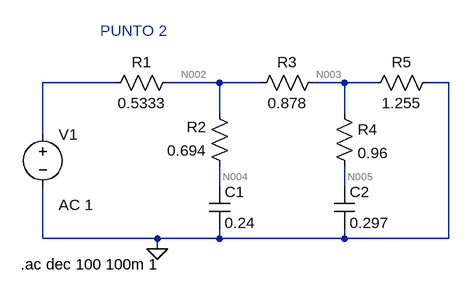
[diagram p0: schematic punto_2.asc]
punto_2.asc, the LTspice schematic file:
Version 4
SHEET 1 1124 680
WIRE 80 -32 -32 -32
WIRE 240 -32 160 -32
WIRE 304 -32 240 -32
WIRE 432 -32 384 -32
WIRE 480 -32 432 -32
WIRE 592 -32 560 -32
WIRE 240 16 240 -32
WIRE 432 16 432 -32
WIRE -32 48 -32 -32
WIRE 240 128 240 96
WIRE 432 128 432 96
WIRE -32 208 -32 128
WIRE 144 208 -32 208
WIRE 240 208 240 192
WIRE 240 208 144 208
WIRE 432 208 432 192
WIRE 432 208 240 208
WIRE 592 208 592 -32
WIRE 592 208 432 208
WIRE 144 224 144 208
FLAG 144 224 0
SYMBOL voltage -32 32 R0
WINDOW 123 24 124 Left 2
WINDOW 39 0 0 Left 0
SYMATTR InstName V1
SYMATTR Value ""
SYMATTR Value2 AC 1
SYMBOL res 176 -48 R90
WINDOW 0 0 56 VBottom 2
WINDOW 3 32 56 VTop 2
SYMATTR InstName R1
SYMATTR Value 0.5333
SYMBOL res 256 112 R180
WINDOW 0 36 76 Left 2
WINDOW 3 36 40 Left 2
SYMATTR InstName R2
SYMATTR Value 0.694
SYMBOL res 288 -16 R270
WINDOW 0 32 56 VTop 2
WINDOW 3 0 56 VBottom 2
SYMATTR InstName R3
SYMATTR Value 0.878
SYMBOL res 416 0 R0
SYMATTR InstName R4
SYMATTR Value 0.96
SYMBOL res 576 -48 R90
WINDOW 0 0 56 VBottom 2
WINDOW 3 32 56 VTop 2
SYMATTR InstName R5
SYMATTR Value 1.255
SYMBOL cap 224 128 R0
SYMATTR InstName C1
SYMATTR Value 0.24
SYMBOL cap 416 128 R0
SYMATTR InstName C2
SYMATTR Value 0.297
TEXT -66 248 Left 2 !.ac dec 100 100m 1
TEXT 56 -112 Left 2 ;PUNTO 2

The netlist it stands for:
* punto_2.asc
V1 N001 0 AC 1
R1 N002 N001 0.5333
R2 N004 N002 0.694
R3 N002 N003 0.878
R4 N003 N005 0.96
R5 0 N003 1.255
C1 N004 0 0.24
C2 N005 0 0.297
.ac dec 100 100m 1
* PUNTO 2
.backanno
.end

* Results of the author's LTspice run, read from the files saved beside the schematic
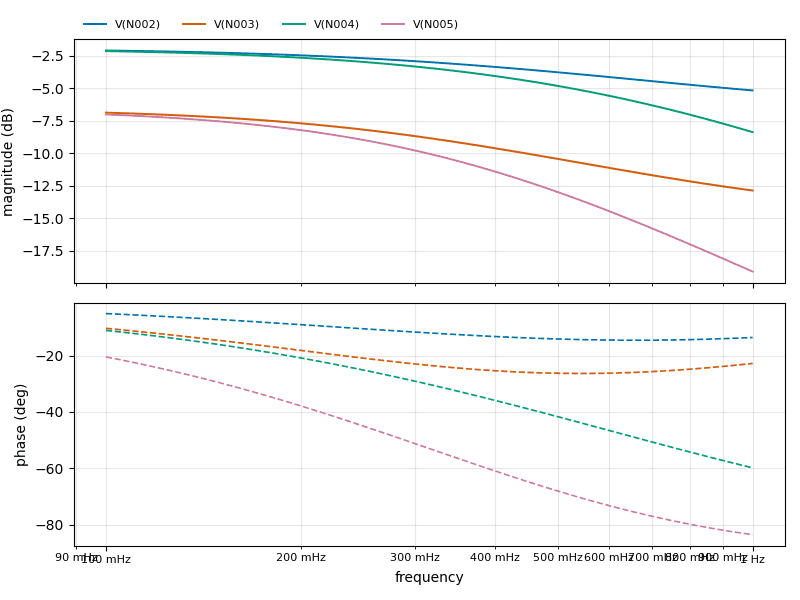
[diagram p1: AC Analysis of punto_2.asc, plotted from the saved traces]
* AC Analysis, 1 run:
*   V(N002): -2.09 dB at 100 mHz, -5.17 dB at 1 Hz, peak -2.09 dB at 100 mHz, 3 dB below the peak at 966 mHz
*   V(N003): -6.88 dB at 100 mHz, -12.87 dB at 1 Hz, peak -6.88 dB at 100 mHz, 3 dB below the peak at 431.1 mHz
*   V(N004): -2.14 dB at 100 mHz, -8.38 dB at 1 Hz, peak -2.14 dB at 100 mHz, 3 dB below the peak at 543 mHz
*   V(N005): -7.02 dB at 100 mHz, -19.11 dB at 1 Hz, peak -7.02 dB at 100 mHz, 3 dB below the peak at 315 mHz